# EAGLE design D1 - TH LCD Dupont RJ45 (EAGLE 9.6.2)
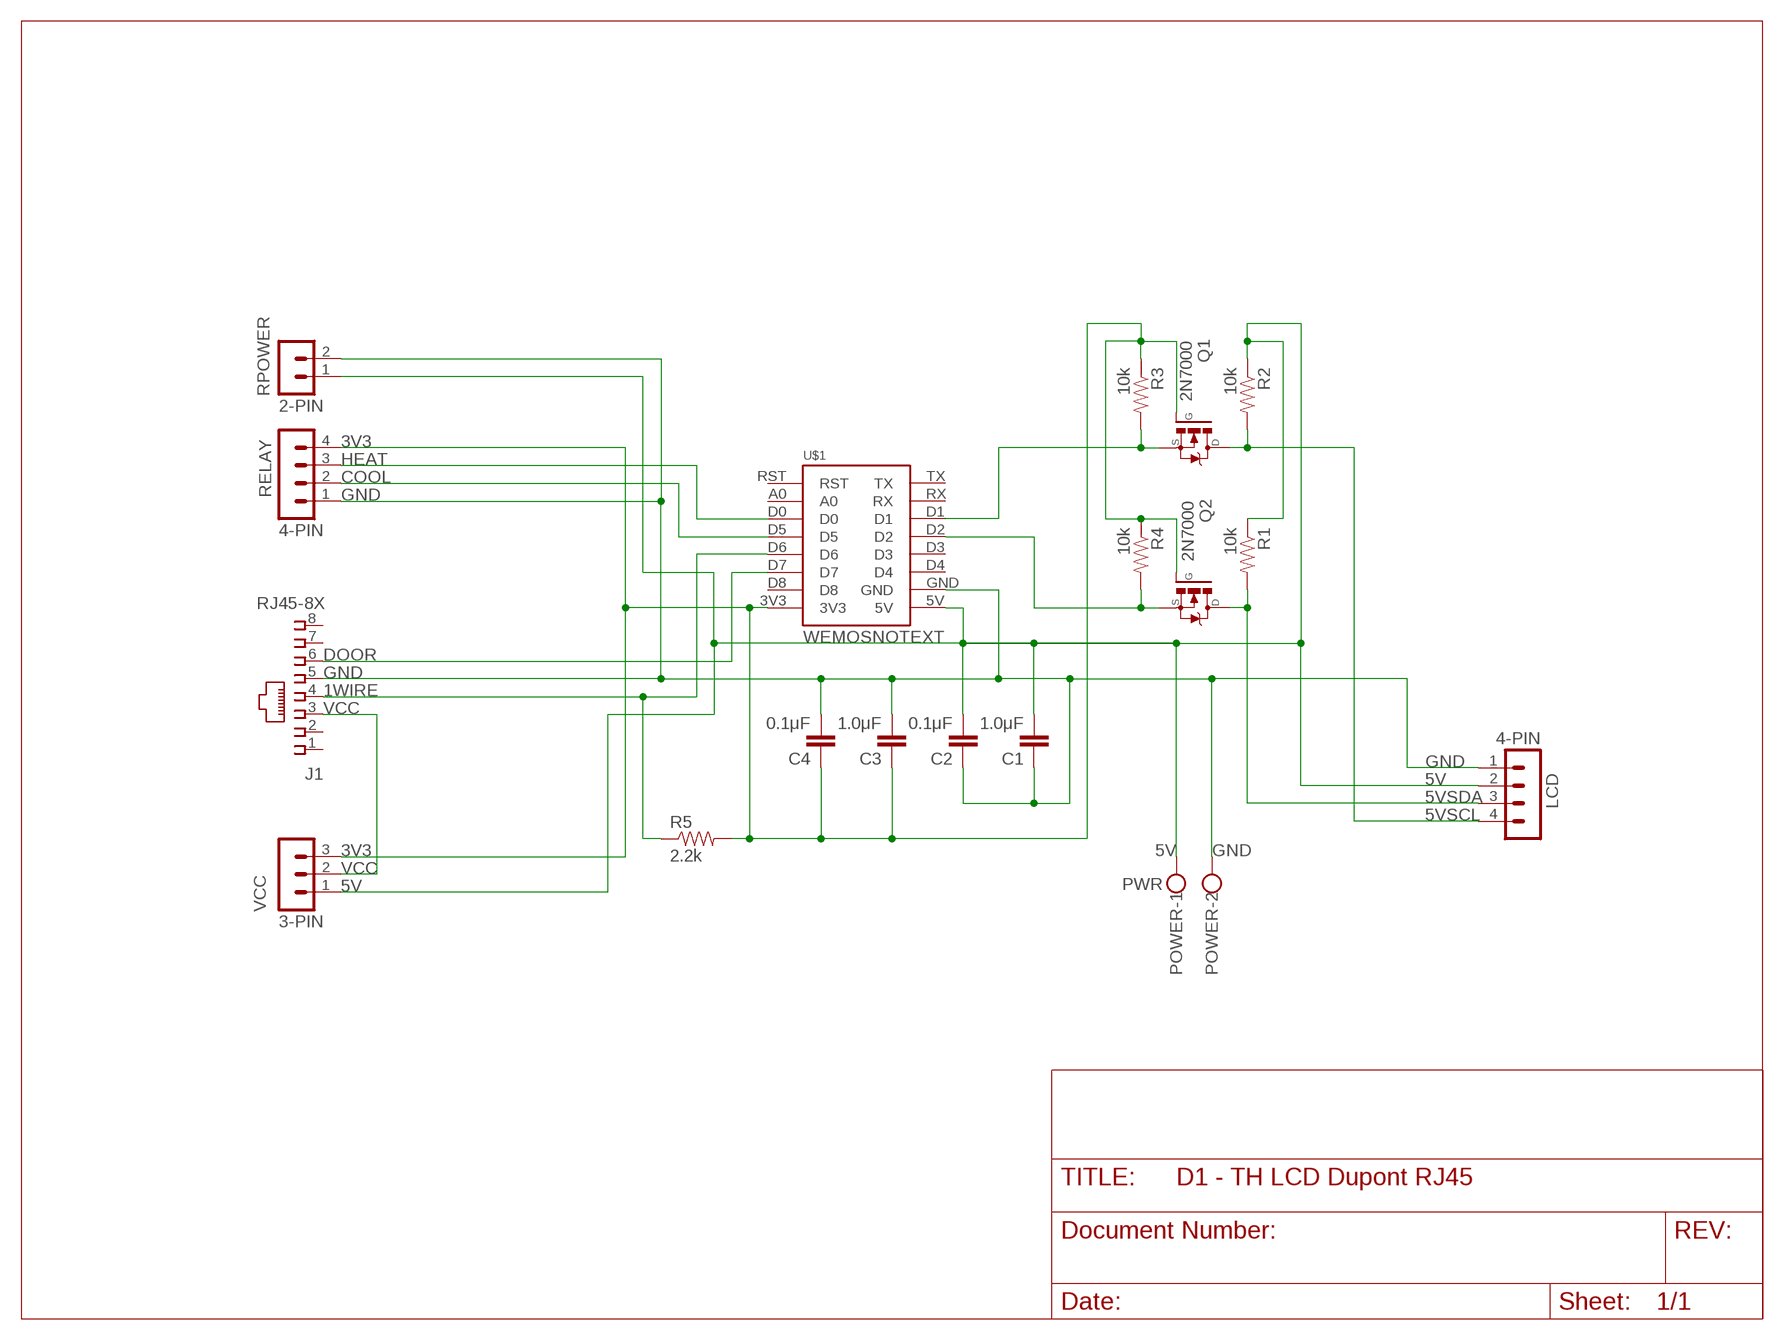
[diagram p0: schematic, sheet 1]

## Parts
C1  1.0μF  CAP_CERAMIC_2.54  [CAP_PTH-2.54]
C2  0.1μF  CAP_CERAMIC_2.54  [CAP_PTH-2.54]
C3  1.0μF  CAP_CERAMIC_2.54  [CAP_PTH-2.54]
C4  0.1μF  CAP_CERAMIC_2.54  [CAP_PTH-2.54]
J1  RJ45-8X  [RJ45-NO-SHIELD-NOLINE]
LCD  4-PIN  HDR-4  [HDR-4_VERT]
POWER  PWR  W237-102  [W237-102]
Q1  2N7000  [TO-92]
Q2  2N7000  [TO-92]
R1  10k  10KOHM-HORIZ-1/4W-1%  [AXIAL-0.3]
R2  10k  10KOHM-HORIZ-1/4W-1%  [AXIAL-0.3]
R3  10k  10KOHM-HORIZ-1/4W-1%  [AXIAL-0.3]
R4  10k  10KOHM-HORIZ-1/4W-1%  [AXIAL-0.3]
R5  2.2k  10KOHM-HORIZ-1/4W-1%  [AXIAL-0.3]
RELAY  4-PIN  HDR-4  [HDR-4_VERT]
RPOWER  2-PIN  HDR-2  [HDR-2_VERT]
U$1  WEMOSNOTEXT  [WEMOS_D1-NOTEXT]
VCC  3-PIN  MA03-1  [MA03-1]

## Nets
1WIRE: J1.4 R5.P$1 U$1.D6
3V3 [3v]: C3.1 C4.1 Q1.2(G) Q2.2(G) R3.P$1 R4.P$1 R5.P$2 RELAY.4 U$1.3V3 VCC.3
3VSCL: Q1.1(S) R3.P$2 U$1.D1
3VSDA: Q2.1(S) R4.P$2 U$1.D2
5V [5v]: C1.2 C2.2 LCD.2 POWER.1 R1.P$1 R2.P$1 RPOWER.1 U$1.5V VCC.1
5VSCL: LCD.4 Q1.3(D) R2.P$2
5VSDA: LCD.3 Q2.3(D) R1.P$2
COOL: RELAY.2 U$1.D5
DOOR: J1.6 U$1.D7
GND [Gnd]: C1.1 C2.1 C3.2 C4.2 J1.5 LCD.1 POWER.2 RELAY.1 RPOWER.2 U$1.GND
HEAT: RELAY.3 U$1.D0
VCC: J1.3 VCC.2
Unconnected: J1.1 J1.2 J1.7 J1.8 U$1.A0 U$1.D3 U$1.D4 U$1.D8 U$1.RST U$1.RX U$1.TX

## Library data of the parts
C1-C4 = Donnie:CAP_CERAMIC_2.54
J1 = con-tycoelectronics:RJ45: CORCOM Modular RJ Jacks No Shield Source: www.tycoelectronics.com .. ENG_DS_1654001_1099_RJ_L_0507.pdf; MPN: RJ45-8X; OC_FARNELL: unknown; OC_NEWARK: 16R6101
LCD RELAY = Donnie:HDR-4: PIN HEADER
POWER = con-wago-500:W237-102: WAGO SCREW CLAMP; MPN: 237-102; OC_FARNELL: unknown; OC_NEWARK: 70K9898
Q1 Q2 = Donnie:2N7000
R1-R4 = SparkFun-Resistors:10KOHM: 10kΩ resistor A resistor is a passive two-terminal electrical component that implements electrical resistance as a circuit element. Resistors act to reduce current flow, and, at the same time, act to lower voltage levels within circuits. - Wikipedia; PROD_ID: RES-12183
R5 = SparkFun-Resistors:10KOHM: 10kΩ resistor A resistor is a passive two-terminal electrical component that implements electrical resistance as a circuit element. Resistors act to reduce current flow, and, at the same time, act to lower voltage levels within circuits. - Wikipedia; PROD_ID: RES-12183; VALUE: 10k
RPOWER = Donnie:HDR-2
U$1 = Wemos:WEMOS
VCC = con-lstb:MA03-1: PIN HEADER; OC_FARNELL: unknown; OC_NEWARK: unknown

## Net classes
0 default: width 0.305 mm, clearance 0.305 mm
1 5v: width 0.406 mm, clearance 0.406 mm
2 3v: width 0.406 mm, clearance 0.406 mm
3 Gnd: width 0.406 mm, clearance 0.406 mm

## Board
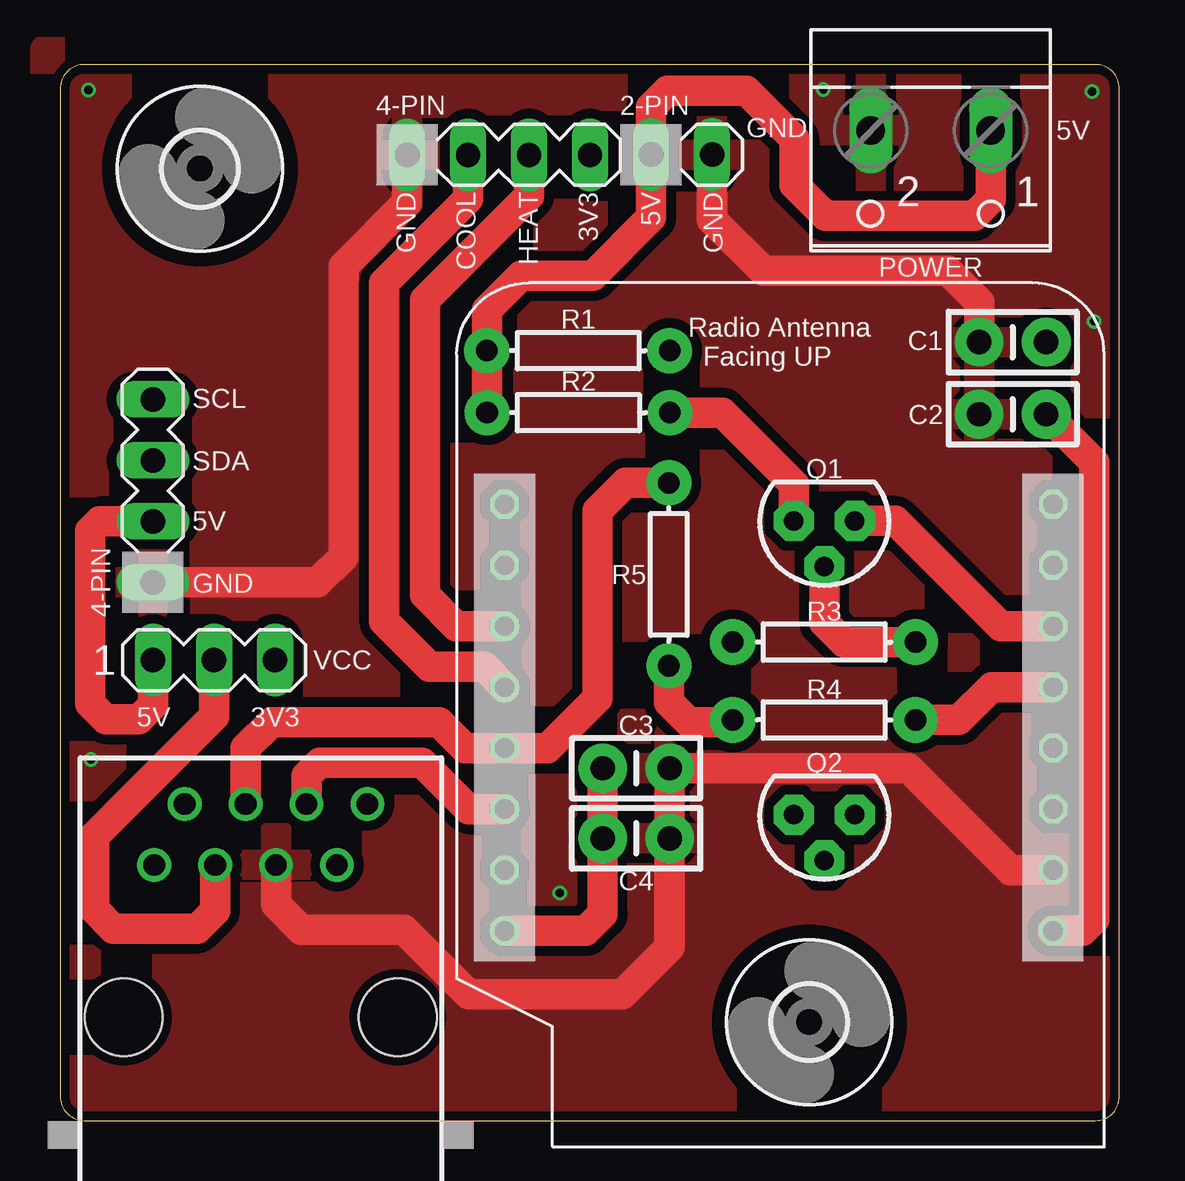
[diagram p1: board, top side]
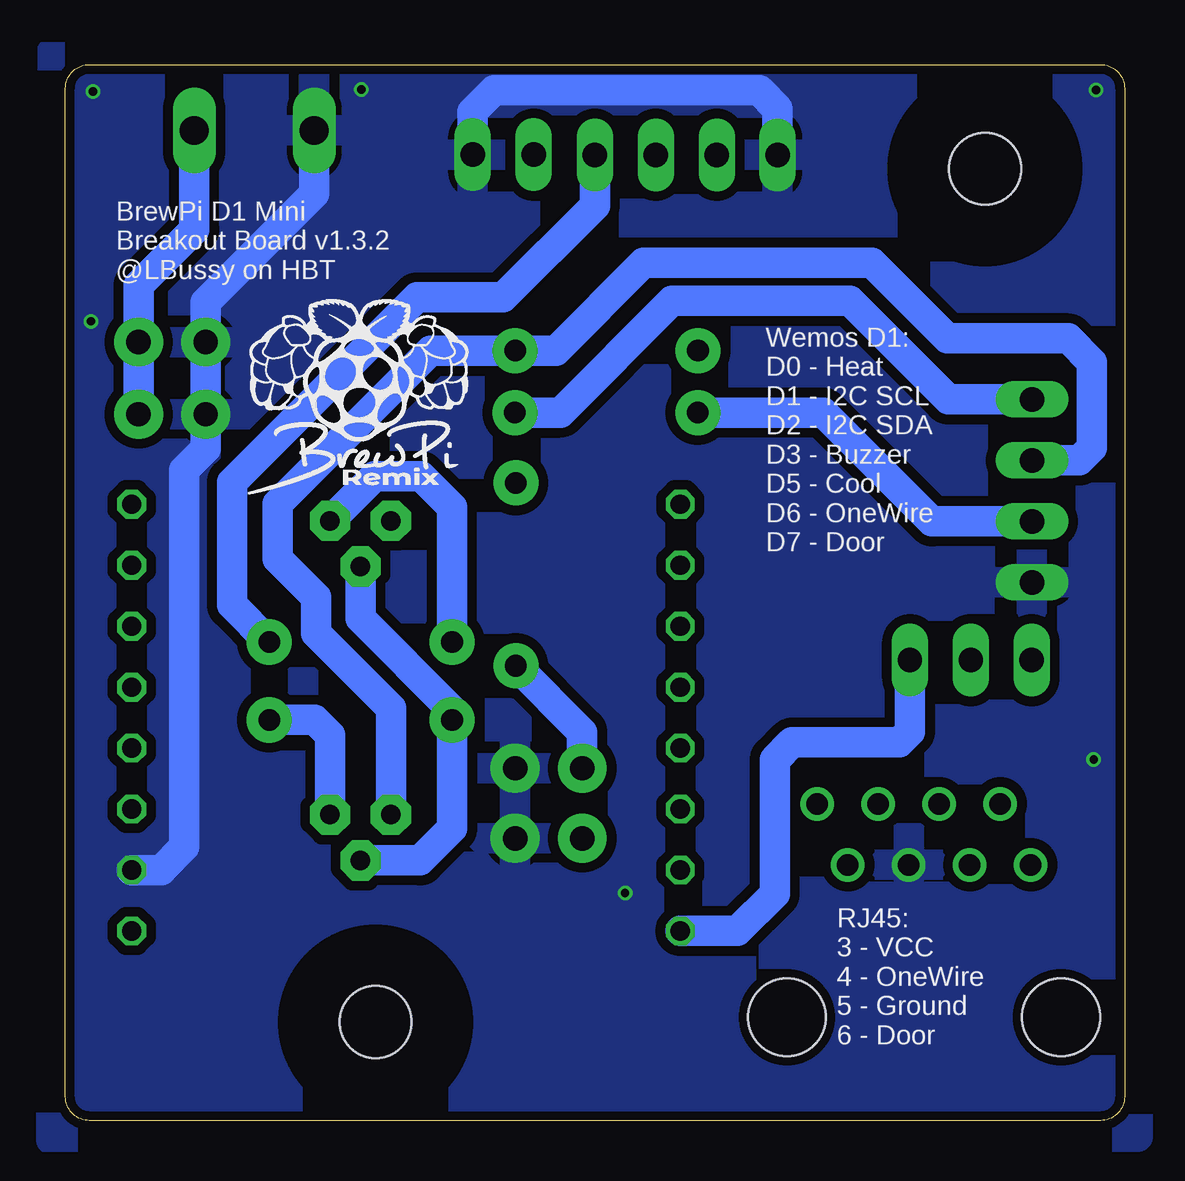
[diagram p2: board, bottom side, seen from below]

Size 44.15 x 44 mm. Coordinates in mm from the lower left corner, seen from the top.
Outline: 0,43 0,1 arc90 1,0 43.15,0 arc90 44.15,1 44.15,43 arc90 43.15,44 1,44 arc90 0,43
Copper layers (1*16): Top 0.035559375mm / dielectric 1.6mm / Bottom 0.035559375mm
Design rules "oshpark-2layer *": minimum track width 6mil, minimum drill 10mil, track to track 8mil, track to pad 8mil, pad to pad 8mil, via to via 8mil, smd to smd 8mil, copper to edge 15mil, drill to drill 8mil, minimum pad ring 5mil, minimum via ring 5mil, stop-mask expansion 2.5mil, vias tented up to drill 30mil, thermal gap 10mil

### Footprints (pad centres in the part's own frame; a part is rotated, then mirrored left to right if it is on the bottom)
CAP_PTH-2.54 = drill 1.016 pad 2.032: 1 -1.397,0; 2 1.397,0
RJ45-NO-SHIELD-NOLINE = drill 0.9 pad 1.4: 1 -4.445,6.35; 2 -3.175,8.89; 3 -1.905,6.35; 4 -0.635,8.89; 5 0.635,6.35; 6 1.905,8.89; 7 3.175,6.35; 8 4.445,8.89 | hole 3.251: -5.715,0; 5.715,0
HDR-4_VERT = drill 1.016 long: 1 0,0; 2 2.54,0; 3 5.08,0; 4 7.62,0
W237-102 = drill 1.194 long: 1 -2.5,-1.27; 2 2.5,-1.27
TO-92 = drill 0.813 pad 1.676 octagon: 1 -1.27,0; 2 0,1.905; 3 1.27,0
AXIAL-0.3 = drill 0.9 pad 1.88: P$1 -3.81,0; P$2 3.81,0
HDR-2_VERT = drill 1.016 long: 1 0,0; 2 2.54,0
WEMOS_D1-NOTEXT = drill 0.8 octagon: 3V3 0,0; 5V 22.86,0; A0 0,15.24; D0 0,12.7; D1 22.86,12.7; D2 22.86,10.16; D3 22.86,7.62; D4 22.86,5.08; D5 0,10.16; D6 0,7.62; D7 0,5.08; D8 0,2.54; GND 22.86,2.54; RST 0,17.78; RX 22.86,15.24; TX 22.86,17.78
3,0 = hole 3: 0,0
MA03-1 = drill 1.016 long: 1 -2.54,0; 2 0,0; 3 2.54,0

### Placement (x,y rotation side)
C1  39.7,32.44 0 top
C2  39.7,29.43 0 top
C3  24,14.68 0 top
C4  24,11.76 0 top
J1  8.36,4.3 0 top
LCD  3.86,22.43 90 top
POWER  36.28,39.98 180 top
Q1  31.85,24.99 180 top
Q2  31.85,12.74 180 top
R1  21.59,32.08 0 top
R2  21.6,29.5 0 top
R3  31.84,19.94 180 top
R4  31.84,16.69 0 top
R5  25.37,22.76 270 top
RELAY  14.46,40.23 0 top
RPOWER  24.63,40.25 0 top
U$1  18.52,7.9 0 top
U$2  [3,0]  5.82,39.66 0 top
U$4  [3,0]  31.22,4.1 0 top
VCC  6.41,19.19 0 top

### Tracks (layer width: path | path; a pad name or v marks a point on that pad's centre or on a via)
1WIRE
  Top 1.27: R5.P$1 23.57,26.57 22.4,25.4 22.4,17.6 20.32,15.52 U$1.D6 16.88,15.52 15.8,16.6 8.8,16.6 7.72,15.53 J1.4
3V3
  Top 1.27: U$1.3V3 21.9,7.9 22.61,8.61 C4.1 C3.1 | R4.P$1 27.94,16.6 26.2,16.6 25.37,17.43 R5.P$2 | R3.P$1 32.66,19.94 31.85,20.75 Q1.2
  Bottom 1.27: R3.P$1 37.2,21.49 37.2,26.6 29.5,34.3 25.9,34.3 22.08,38.12 RELAY.4 | Q1.2 31.85,20.92 28.03,17.1 R4.P$1 28.03,12.17 29.36,10.84 Q2.2 | R5.P$2 22.61,16.19 C3.1 | U$1.3V3 16.13,7.9 14.58,9.45 14.58,15.04 13.87,15.75 9.39,15.75 8.95,16.2 VCC.3
3VSCL
  Top 1.27: U$1.D1 39.2,20.6 34.81,24.99 Q1.1
  Bottom 1.27: R3.P$2 28.03,25.55 29.33,26.85 31.26,26.85 | 31.26,26.85 | 31.26,26.85 Q1.1
3VSDA
  Top 1.27: R4.P$2 37.46,16.69 38.83,18.06 U$1.D2
  Bottom 1.27: R4.P$2 33.76,16.69 33.12,16.05 Q2.1
5V
  Top 1.27: R2.P$1 R1.P$1 17.78,33.78 19.2,35.2 22.2,35.2 24.63,37.63 RPOWER.1 24.63,42.23 25.3,42.9 28.6,42.9 30.6,40.9 30.6,39 31.9,37.7 38.1,37.7 38.78,38.38 POWER.1 | C2.2 43.11,27.42 43.11,9.63 43.11,8.38 42.63,7.9 U$1.5V | LCD.2 1.65,24.96 1.26,24.57 1.26,17.37 1.9,16.73 3.27,16.73 3.87,17.32 VCC.1
  Bottom 1.27: POWER.1 38.78,37.12 41.1,34.8 C1.2 C2.2 | LCD.2 8.02,24.96 12.56,29.5 R2.P$1
5VSCL
  Top 1.27: R2.P$2 27.6,29.5 30.58,26.52 Q1.3
  Bottom 1.27: R2.P$2 23.51,29.5 18.86,34.15 11.46,34.15 7.35,30.05 LCD.4
5VSDA
  Bottom 1.27: Q2.3 30.58,17.18 33.7,20.3 33.7,21.8 35.3,23.4 35.3,25.7 28.92,32.08 R1.P$2 23.71,32.08 20.05,35.74 10.54,35.74 7.39,32.59 2.34,32.59 1.36,31.6 1.36,28.03 1.88,27.5 LCD.3
COOL
  Top 1.27: RELAY.2 17,38.4 13.5,34.9 13.5,20.8 15.4,18.9 17.68,18.9 U$1.D5
DOOR
  Top 1.27: U$1.D7 17.02,12.98 15.09,14.91 11.98,14.91 10.81,14.91 10.27,14.37 J1.6
GND  (via drill 0.35)
  Top 1.27: U$1.GND 39.6,10.44 35.36,14.68 C3.2 C4.2 25.4,7.23 23.43,5.26 17.02,5.26 14.33,7.96 10.05,7.96 8.99,9.01 J1.5 | RPOWER.2 27.17,37.53 29.3,35.4 37,35.4 38.3,34.1 C1.1 | RELAY.1 14.46,38.26 11.8,35.6 11.8,23.5 10.72,22.43 LCD.1
  Bottom 1.27: RPOWER.2 27.17,42.03 26.28,42.92 15.22,42.92 14.46,42.16 RELAY.1 | POWER.2 33.78,38.62 38.3,34.1 C1.1 C2.1 38.3,27.99 39.2,27.09 39.2,26.2 39.2,11.4 40.16,10.44 U$1.GND
  other vias: 1.28,15.04 20.82,9.49 31.81,42.95 43.09,33.3 43,42.88 1.18,42.94
  pour Top: -0.62,44.61 -0.62,-0.07 arc45 -0.5,-0.37 44.47,-0.37 arc-45 44.62,-0.43 44.62,44.48 -0.43,44.54
  pour Bottom: -0.56,44.48 -0.56,-0.68 44.44,-0.68 arc-45 44.74,-0.81 44.74,44.4 arc45 44.68,44.54 0.33,44.54 arc45 0.19,44.48
HEAT
  Top 1.27: RELAY.3 19.54,38.54 15.2,34.2 15.2,21.9 16.5,20.6 U$1.D0
VCC
  Top 1.27: VCC.2 6.41,16.85 1.41,11.85 1.41,8.8 2.21,8 5.7,8 6.46,8.75 J1.3

### Text on the board
tNames: GND | 5V | GND | COOL | HEAT | 3V3 | 5V | GND | SCL | SDA | 5V | GND | 5V | 3V3
bNames: BrewPi D1 Mini / Breakout Board v1.3.2 / @LBussy on HBT | Wemos D1: / D0 - Heat / D1 - I2C SCL / D2 - I2C SDA / D3 - Buzzer / D5 - Cool / D6 - OneWire / D7 - Door | RJ45: / 3 - VCC / 4 - OneWire / 5 - Ground / 6 - Door